# Altium schematic sheet Power system 2.SchDoc: Power system 2
size A3; Author: Vi Tín; SheetNumber: 4; SheetTotal: 15
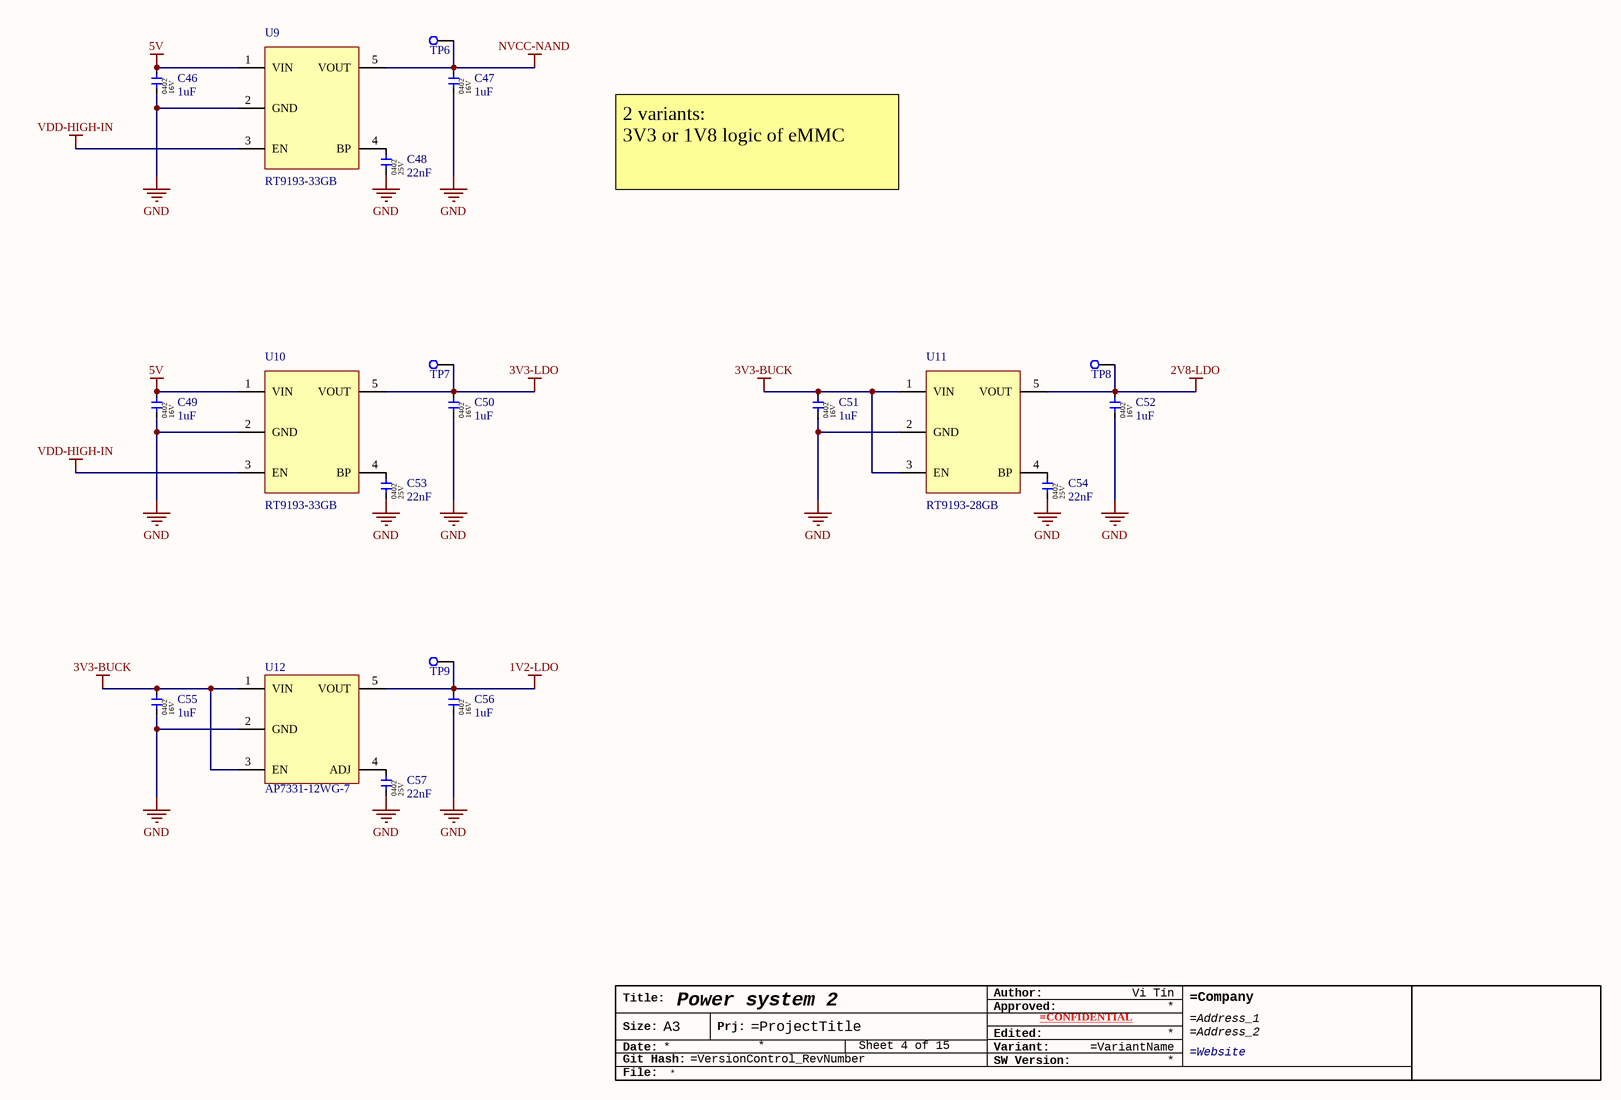
[diagram p0: Power system 2.SchDoc]

## Parts
*?  TitleBlock_Generic  (value not drawn)  (graphical)
C46  1uF  [CAP-0402]
C47  1uF  [CAP-0402]
C48  22nF  [CAP-0402]
C49  1uF  [CAP-0402]
C50  1uF  [CAP-0402]
C51  1uF  [CAP-0402]
C52  1uF  [CAP-0402]
C53  22nF  [CAP-0402]
C54  22nF  [CAP-0402]
C55  1uF  [CAP-0402]
C56  1uF  [CAP-0402]
C57  22nF  [CAP-0402]
TP6  N/A  [Test point]  (value not drawn)  (no BOM)
TP7  N/A  [Test point]  (value not drawn)  (no BOM)
TP8  N/A  [Test point]  (value not drawn)  (no BOM)
TP9  N/A  [Test point]  (value not drawn)  (no BOM)
U9  RT9193-33GB  [SOT23-5]
U10  RT9193-33GB  [SOT23-5]
U11  RT9193-28GB  [SOT23-5]
U12  AP7331-12WG-7  [SOT23-5]

## Nets
1V2-LDO: C56.2 TP9.1 U12.5(VOUT)
2V8-LDO: C52.2 TP8.1 U11.5(VOUT)
3V3-BUCK: C51.2 C55.2 U11.1(VIN) U11.3(EN) U12.1(VIN) U12.3(EN)
3V3-LDO: C50.2 TP7.1 U10.5(VOUT)
5V: C46.2 C49.2 U9.1(VIN) U10.1(VIN)
GND: C46.1 C47.1 C48.1 C49.1 C50.1 C51.1 C52.1 C53.1 C54.1 C55.1 C56.1 C57.1 U9.2(GND) U10.2(GND) U11.2(GND) U12.2(GND)
NVCC-NAND: C47.2 TP6.1 U9.5(VOUT)
VDD-HIGH-IN: U9.3(EN) U10.3(EN)
NetC48_2: C48.2 U9.4(BP)
NetC53_2: C53.2 U10.4(BP)
NetC54_2: C54.2 U11.4(BP)
NetC57_2: C57.2 U12.4(ADJ)

## Notes on the sheet
- 2 variants:
  3V3 or 1V8 logic of eMMC
- (in symbol TitleBlock_Generic) Author:; Title:; Approved:; Size:; A3; Prj:; Edited:; Date:; Variant:; SW Version:; Git Hash:; File:

## Library data of the parts
C46 C47 C49-C52 C55 C56 = 0402X105K160CT: 1uF ±10% 16V X5R 0402 Multilayer Ceramic Capacitors MLCC - SMD/SMT RoHS; Manufacture: WALSIN; Package / Case: 0402; Component type: Capacitor; Manufacture part: 0402X105K160CT; Capacitor value: 1uF; Voltage: 16V; Package: 0402
C48 C53 C54 C57 = 0402B223K250CT: 22nF ±10% 25V X7R 0402 Multilayer Ceramic Capacitors MLCC - SMD/SMT RoHS; Manufacture: WALSIN; Package / Case: 0402; Component type: Capacitor; Manufacture part: 0402B223K250CT; Capacitor value: 22nF; Voltage: 25V; Package: 0402
TP6-TP9 = N/A: A point used for measure.; Manufacture part: N/A; Manufacture: N/A; Type: Test point
U9 U10 = RT9193-33GB: Fixed 5.5V 3.3V 300mV @ 300mA SOT-23-5 Dropout Regulators(LDO) RoHS; Manufacture: Richtek Tech; Manufacture part: RT9193-33GB; Type: LDO; Package: SOT23-5; Datasheet: https://datasheet.lcsc.com/lcsc/Richtek-Tech-RT9193-28GB_C56731.pdf
U11 = RT9193-28GB: Fixed 5.5V 2.8V 300mV @ 300mA SOT-23-5 Dropout Regulators(LDO) RoHS; Manufacture: Richtek Tech; Manufacture part: RT9193-28GB; Type: LDO; Package: SOT23-5; Datasheet: https://datasheet.lcsc.com/lcsc/Richtek-Tech-RT9193-28GB_C56731.pdf
U12 = AP7331-12WG-7: Fixed 6V 1.2V 550mV @ 300mA SOT-25 Dropout Regulators(LDO) RoHS; Manufacture: Diodes Incorporated; Part number: AP7331-WG-7; Manufacture part: AP7331-12WG-7; Type: LDO; Package: SOT23-5; Datasheet: https://datasheet.lcsc.com/lcsc/Diodes-Incorporated-AP7331-WG-7_C212322.pdf
*? = TitleBlock_Generic: Manufacture part: TitleBlock_Generic; Manufacture: N/A; Type: Graphic